# Altium schematic sheet [02] - DISPLAY.SchDoc: Desk Digital Clock
size A4; DrawnBy: teregulov; SheetNumber: 2
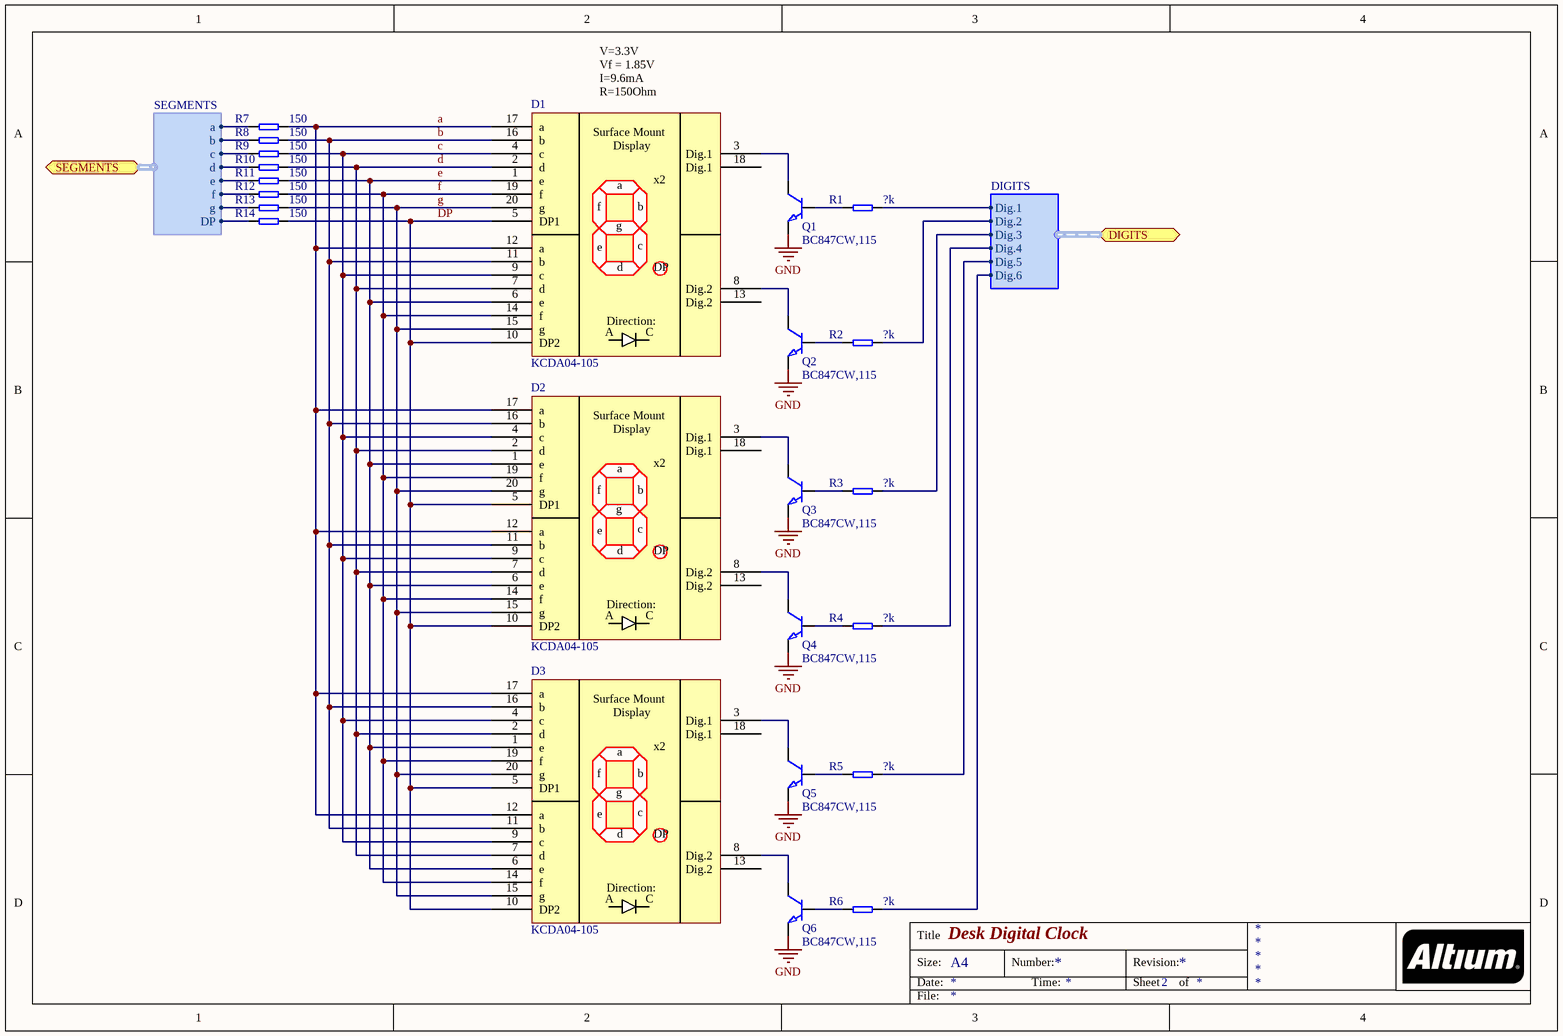
[diagram p0: [02] - DISPLAY.SchDoc]

## Parts
D1  KCDA04-105
D2  KCDA04-105
D3  KCDA04-105
Q1  BC847CW,115
Q2  BC847CW,115
Q3  BC847CW,115
Q4  BC847CW,115
Q5  BC847CW,115
Q6  BC847CW,115
R1  ?k
R2  ?k
R3  ?k
R4  ?k
R5  ?k
R6  ?k
R7  150
R8  150
R9  150
R10  150
R11  150
R12  150
R13  150
R14  150

## Ports
DIGITS (harness DIGITS), SEGMENTS (harness SEGMENTS)

## Harnesses
SEGMENTS: a, b, c, d, e, f, g, DP
DIGITS: Dig.1, Dig.2, Dig.3, Dig.4, Dig.5, Dig.6

## Nets
GND: Q1.E Q2.E Q3.E Q4.E Q5.E Q6.E
a: D1.12(a) D1.17(a) D2.12(a) D2.17(a) D3.12(a) D3.17(a) R7.2
b: D1.11(b) D1.16(b) D2.11(b) D2.16(b) D3.11(b) D3.16(b) R8.2
c: D1.4(c) D1.9(c) D2.4(c) D2.9(c) D3.4(c) D3.9(c) R9.2
d: D1.2(d) D1.7(d) D2.2(d) D2.7(d) D3.2(d) D3.7(d) R10.2
DP: D1.5(DP1) D1.10(DP2) D2.5(DP1) D2.10(DP2) D3.5(DP1) D3.10(DP2) R14.2
e: D1.1(e) D1.6(e) D2.1(e) D2.6(e) D3.1(e) D3.6(e) R11.2
f: D1.14(f) D1.19(f) D2.14(f) D2.19(f) D3.14(f) D3.19(f) R12.2
g: D1.15(g) D1.20(g) D2.15(g) D2.20(g) D3.15(g) D3.20(g) R13.2
NetD1_3: D1.3(Dig.1) Q1.C
NetD1_8: D1.8(Dig.2) Q2.C
NetD2_3: D2.3(Dig.1) Q3.C
NetD2_8: D2.8(Dig.2) Q4.C
NetD3_3: D3.3(Dig.1) Q5.C
NetD3_8: D3.8(Dig.2) Q6.C
NetQ1_B: Q1.B R1.1
NetQ2_B: Q2.B R2.1
NetQ3_B: Q3.B R3.1
NetQ4_B: Q4.B R4.1
NetQ5_B: Q5.B R5.1
NetQ6_B: Q6.B R6.1
NetR1_2: R1.2 ; port DIGITS.Dig.1
NetR2_2: R2.2 ; port DIGITS.Dig.2
NetR3_2: R3.2 ; port DIGITS.Dig.3
NetR4_2: R4.2 ; port DIGITS.Dig.4
NetR5_2: R5.2 ; port DIGITS.Dig.5
NetR6_2: R6.2 ; port DIGITS.Dig.6
NetR7_1: R7.1 ; port SEGMENTS.a
NetR8_1: R8.1 ; port SEGMENTS.b
NetR9_1: R9.1 ; port SEGMENTS.c
NetR10_1: R10.1 ; port SEGMENTS.d
NetR11_1: R11.1 ; port SEGMENTS.e
NetR12_1: R12.1 ; port SEGMENTS.f
NetR13_1: R13.1 ; port SEGMENTS.g
NetR14_1: R14.1 ; port SEGMENTS.DP

Not connected (* = marked no-connect by the designer): D1 13(Dig.2) 18(Dig.1); D2 13(Dig.2) 18(Dig.1); D3 13(Dig.2) 18(Dig.1)

## Notes on the sheet
- Vf = 1.85V
- V=3.3V
- (near D1) R=150Ohm
- (near D1) I=9.6mA
- Title
- Size:
- Date:
- A4
- Number:
- Time:
- Revision:
- Sheet
- of
- File:
- (in symbol KCDA04-105) Surface Mount; Display; x2; DP; Direction:; A; C

## Library data of the parts
D1-D3 = KCDA04-105: Surface Mount Display; Manufacturer: Kingbright; P/N: KCDA04-105; Datasheet: https://www.kingbright.com/attachments/file/psearch/000/00/00/KCDA04-105(Ver.11A).pdf
Q1-Q6 = BC847CW,115: TRANS NPN 45V 0.1A SOT23; Manufacturer: Nexperia USA Inc.; P/N: BC847CW,115; Datasheet: https://assets.nexperia.com/documents/data-sheet/BC847_SER.pdf; Package: SOT23
R1-R14 = Res: RESISTOR
  R1-R6: Value: ?k
  R7-R14: Value: 150